# Altium project Encoder_w_LED_ring.PrjPcb
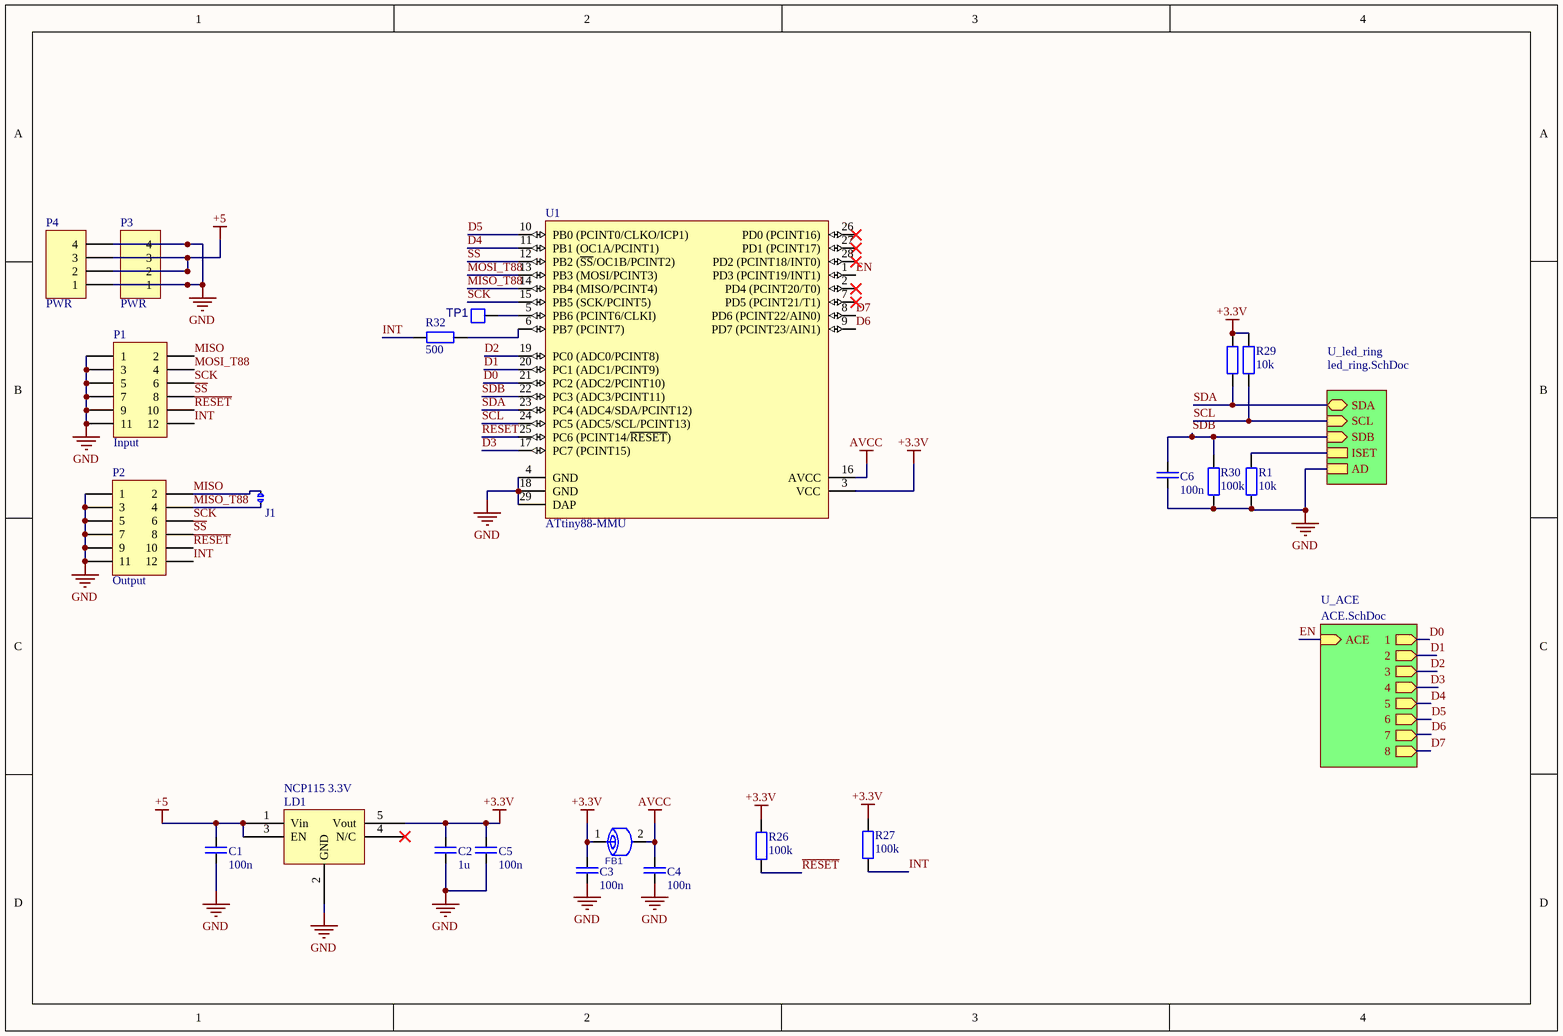
[diagram p0: main_sch.SchDoc]
3 sheets, 82 parts. Net scope: hierarchical (ports join the sheet entries above them; power ports are global).
Board files: PCB1.PcbDoc, PCB2.PcbDoc
Sheets:
  main_sch.SchDoc
    U_led_ring = led_ring.SchDoc
    U_ACE = ACE.SchDoc

## Sheet main_sch.SchDoc
size A4

### Parts
C1  100n  [R1005_0402i_L]
C2  1u  [C1608_0603I_L]
C3  100n  [R1005_0402i_L]
C4  100n  [R1005_0402i_L]
C5  100n  [R1005_0402i_L]
C6  100n  [R1005_0402i_L]
FB1  FERITTE BEAD  [R1608_0603I_L]  (value not drawn)
J1  Terminator  [solderJumper]  (value not drawn)
LD1  NCP115 3.3V  [TSOP95P280X110-6L]
P1  Input  [1.27mm SMD conn]
P2  Output  [1.27mm SMD conn]
P3  PWR  [HDR1X4]
P4  PWR  [HDR1X4]
R1  10k  [R1005_0402i_L]
R26  100k  [R1005_0402i_L]
R27  100k  [R1005_0402i_L]
R28  10k  [R1005_0402i_L]  (value not drawn)
R29  10k  [R1005_0402i_L]
R30  100k  [R1005_0402i_L]
R32  500  [R1005_0402i_L]
TP1  PAD  [PAD]  (value not drawn)
U1  ATtiny88-MMU  [28M1_N]

### Sub-sheets
U_ACE = ACE.SchDoc: 1 (out), 2 (out), 3 (out), 4 (out), 5 (out), 6 (out), 7 (out), 8 (out), ACE (in)
U_led_ring = led_ring.SchDoc: SDA (bidir), SCL (in), SDB (in), ISET, AD

### Nets
+3.3V: C2.1 C3.1 C5.1 FB1.1 LD1.5(Vout) R26.1 R27.1 R28.1 R29.1 U1.3(VCC)
+5: C1.1 LD1.1(Vin) LD1.3(EN) P3.2 P3.3 P4.2 P4.3
AVCC: C4.1 FB1.2 U1.16(AVCC)
GND: C1.2 C2.2 C3.2 C4.2 C5.2 C6.2 LD1.2(GND) P1.1 P1.3 P1.5 P1.7 P1.9 P1.11 P2.1 P2.3 P2.5 P2.7 P2.9 P2.11 P3.1 P3.4 P4.1 P4.4 R1.2 R30.2 U1.4(GND) U1.18(GND) U1.29(DAP) ; sheet U_led_ring/AD
D0: U1.21(PC2_(ADC2/PCINT10)) ; sheet U_ACE/1
D1: U1.20(PC1_(ADC1/PCINT9)) ; sheet U_ACE/2
D2: U1.19(PC0_(ADC0/PCINT8)) ; sheet U_ACE/3
D3: U1.17(PC7_(PCINT15)) ; sheet U_ACE/4
D4: U1.11(PB1_(OC1A/PCINT1)) ; sheet U_ACE/5
D5: U1.10(PB0_(PCINT0/CLKO/ICP1)) ; sheet U_ACE/6
D6: U1.9(PD7_(PCINT23/AIN1)) ; sheet U_ACE/7
D7: U1.8(PD6_(PCINT22/AIN0)) ; sheet U_ACE/8
EN: U1.1(PD3_(PCINT19/INT1)) ; sheet U_ACE/ACE
INT: P1.12 P2.12 R27.2 R32.1
MISO: J1.2 P1.2 P2.2
MISO_T88: J1.1 P2.4 U1.14(PB4_(MISO/PCINT4))
MOSI_T88: P1.4 U1.13(PB3_(MOSI/PCINT3))
~{RESET}: P1.10 P2.10 R26.2 U1.25(PC6_(PCINT14/~{RESET}))
~{SS}: P1.8 P2.8 U1.12(PB2_(~{SS}/OC1B/PCINT2))
SCK: P1.6 P2.6 U1.15(PB5_(SCK/PCINT5))
SCL: R29.2 U1.24(PC5_(ADC5/SCL/PCINT13)) ; sheet U_led_ring/SCL
SDA: R28.2 U1.23(PC4_(ADC4/SDA/PCINT12)) ; sheet U_led_ring/SDA
SDB: C6.1 R30.1 U1.22(PC3_(ADC3/PCINT11)) ; sheet U_led_ring/SDB
NetIS1_25: R1.1 ; sheet U_led_ring/ISET
NetR32_2: R32.2 U1.6(PB7_(PCINT7))
NetTP1_1: TP1.1 U1.5(PB6_(PCINT6/CLKI))

Not connected (* = marked no-connect by the designer): LD1 4(N/C)*; U1 2(PD4_(PCINT20/T0))* 7(PD5_(PCINT21/T1))* 26(PD0_(PCINT16))* 27(PD1_(PCINT17))* 28(PD2_(PCINT18/INT0))*

### Library data of the parts
C1-C6 = C: Capacitor
J1 = JMP_mini
P1 P2 = Header 6X2: Header, 6-Pin, Dual row; LatestRevisionDate: 17-Jul-2002; LatestRevisionNote: Re-released for DXP Platform.; Publisher: Altium Limited
P3 P4 = Header 4: Header, 4-Pin; LatestRevisionDate: 17-Jul-2002; LatestRevisionNote: Re-released for DXP Platform.; Publisher: Altium Limited
R1 R26-R30 R32 = R
U1 = ATtiny88-MMU: 8-bit AVR Microcontroller, 1.8-5.5V, 8KB Flash, 64 Bytes EEPROM, 512 Bytes SRAM, 28-pin MLF, Industrial Grade (-40°C to 85°C), Pb-Free; Published: 1-Apr-2010; DatasheetVersion: revC, Mar-2009; PackageVersion: revB, Nov-2008; PackageReference: 28M1; Publisher: Altium Limited; PackageDescription: 28-pad, 4x4x1.0mm Body, Pitch 0.45mm, 2.4x2.4mm Exposed Pad, Plastic Very Thin QFN Package (VQFN); Supplier 1: Digi-Key; Supplier Part Number 1: ATTINY88-MMU-ND; Supplier 2: Mouser; Supplier Part Number 2: 556-ATTINY88-MMU; ComponentLink1Description: Manufacturer Link; ComponentLink1URL: http://www.atmel.com/products/avr/default.asp?; ComponentLink2Description: ATtiny48/88 Datasheet; ComponentLink2URL: http://www.atmel.com/dyn/resources/prod_documents/doc8008.pdf; ComponentLink3Description: ATtiny48/88 Summary; ComponentLink3URL: http://www.atmel.com/dyn/resources/prod_documents/8008S.pdf; ComponentLink4Description: Atmel.com Home; ComponentLink4URL: http://www.atmel.com

## Sheet led_ring.SchDoc
size A4
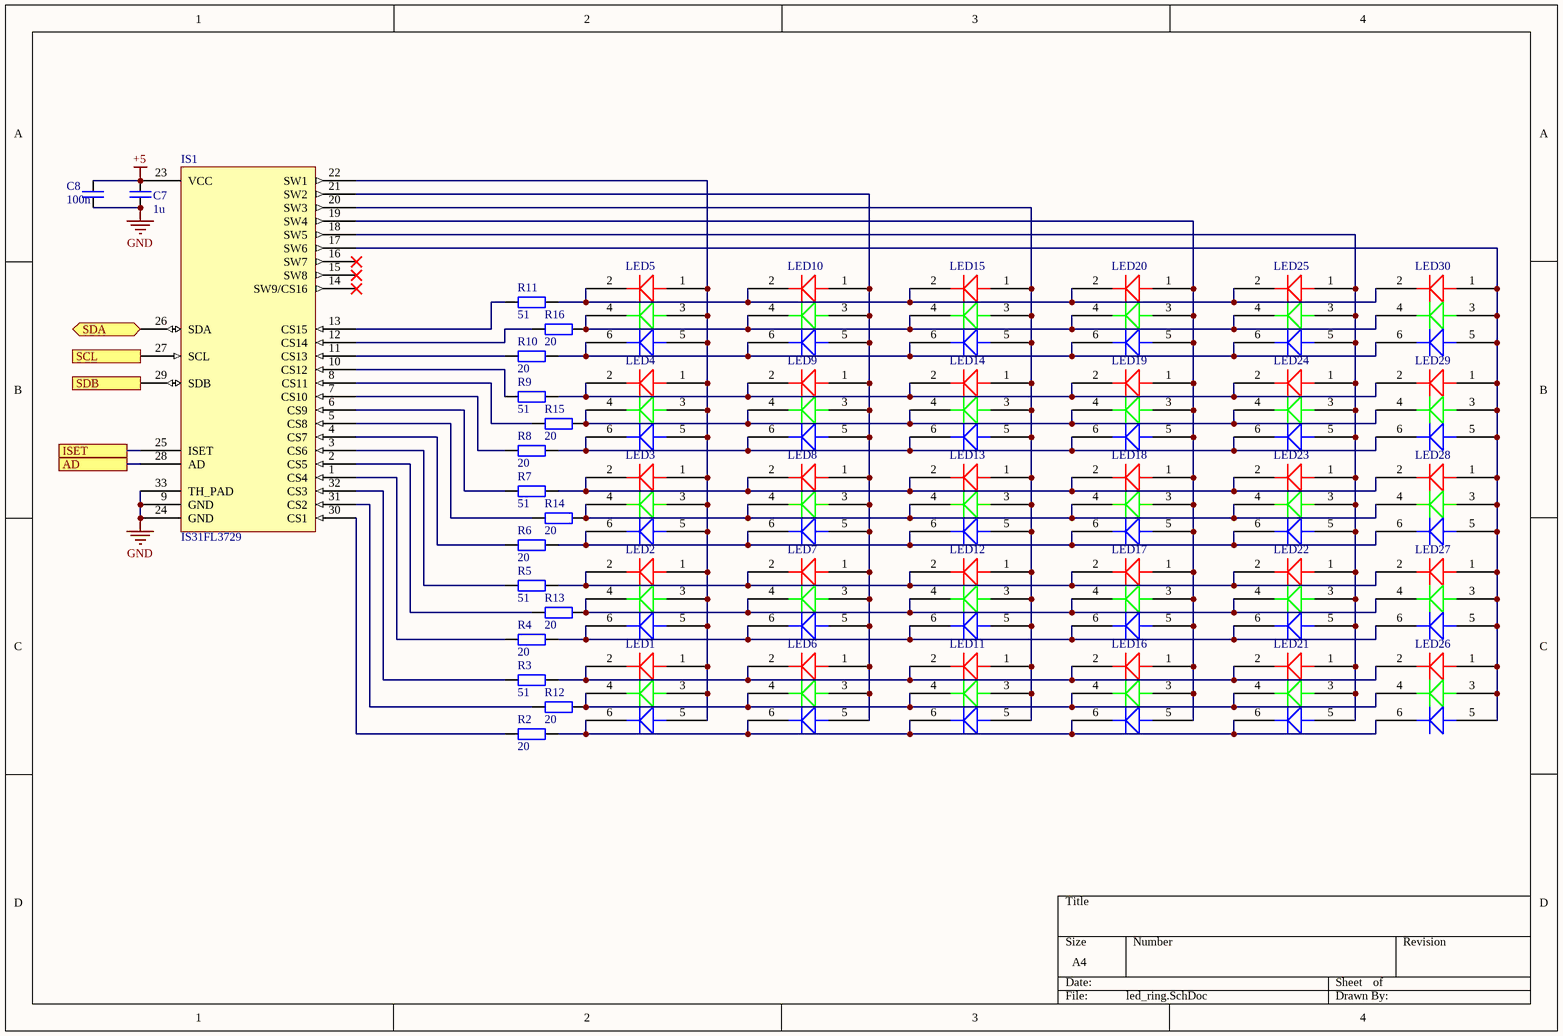
[diagram p1: led_ring.SchDoc]

### Parts
C7  1u  [C1608_0603I_L]
C8  100n  [R1005_0402i_L]
IS1  IS31FL3729  [QFN40P400X400X80_HS-33L]
LED1  SMB-LED  [ASMB-LED]  (value not drawn)
LED2  SMB-LED  [ASMB-LED]  (value not drawn)
LED3  SMB-LED  [ASMB-LED]  (value not drawn)
LED4  SMB-LED  [ASMB-LED]  (value not drawn)
LED5  SMB-LED  [ASMB-LED]  (value not drawn)
LED6  SMB-LED  [ASMB-LED]  (value not drawn)
LED7  SMB-LED  [ASMB-LED]  (value not drawn)
LED8  SMB-LED  [ASMB-LED]  (value not drawn)
LED9  SMB-LED  [ASMB-LED]  (value not drawn)
LED10  SMB-LED  [ASMB-LED]  (value not drawn)
LED11  SMB-LED  [ASMB-LED]  (value not drawn)
LED12  SMB-LED  [ASMB-LED]  (value not drawn)
LED13  SMB-LED  [ASMB-LED]  (value not drawn)
LED14  SMB-LED  [ASMB-LED]  (value not drawn)
LED15  SMB-LED  [ASMB-LED]  (value not drawn)
LED16  SMB-LED  [ASMB-LED]  (value not drawn)
LED17  SMB-LED  [ASMB-LED]  (value not drawn)
LED18  SMB-LED  [ASMB-LED]  (value not drawn)
LED19  SMB-LED  [ASMB-LED]  (value not drawn)
LED20  SMB-LED  [ASMB-LED]  (value not drawn)
LED21  SMB-LED  [ASMB-LED]  (value not drawn)
LED22  SMB-LED  [ASMB-LED]  (value not drawn)
LED23  SMB-LED  [ASMB-LED]  (value not drawn)
LED24  SMB-LED  [ASMB-LED]  (value not drawn)
LED25  SMB-LED  [ASMB-LED]  (value not drawn)
LED26  SMB-LED  [ASMB-LED]  (value not drawn)
LED27  SMB-LED  [ASMB-LED]  (value not drawn)
LED28  SMB-LED  [ASMB-LED]  (value not drawn)
LED29  SMB-LED  [ASMB-LED]  (value not drawn)
LED30  SMB-LED  [ASMB-LED]  (value not drawn)
R2  20  [R1005_0402i_L]
R3  51  [R1005_0402i_L]
R4  20  [R1005_0402i_L]
R5  51  [R1005_0402i_L]
R6  20  [R1005_0402i_L]
R7  51  [R1005_0402i_L]
R8  20  [R1005_0402i_L]
R9  51  [R1005_0402i_L]
R10  20  [R1005_0402i_L]
R11  51  [R1005_0402i_L]
R12  20  [R1005_0402i_L]
R13  20  [R1005_0402i_L]
R14  20  [R1005_0402i_L]
R15  20  [R1005_0402i_L]
R16  20  [R1005_0402i_L]

### Ports
AD, ISET, SCL (in), SDA (bidir), SDB (in)

### Nets
+5: C7.1 C8.1 IS1.23(VCC)
GND: C7.2 C8.2 IS1.9(GND) IS1.24(GND) IS1.28(AD) IS1.33(TH_PAD) ; port AD
SCL: IS1.27(SCL) ; port SCL
SDA: IS1.26(SDA) ; port SDA
SDB: IS1.29(SDB) ; port SDB
NetIS1_1: IS1.1(CS4) R4.1
NetIS1_2: IS1.2(CS5) R13.1
NetIS1_3: IS1.3(CS6) R5.1
NetIS1_4: IS1.4(CS7) R6.1
NetIS1_5: IS1.5(CS8) R14.1
NetIS1_6: IS1.6(CS9) R7.1
NetIS1_7: IS1.7(CS10) R8.1
NetIS1_8: IS1.8(CS11) R15.1
NetIS1_10: IS1.10(CS12) R9.1
NetIS1_11: IS1.11(CS13) R10.1
NetIS1_12: IS1.12(CS14) R16.1
NetIS1_13: IS1.13(CS15) R11.1
NetIS1_17: IS1.17(SW6) LED26.1 LED26.3 LED26.5 LED27.1 LED27.3 LED27.5 LED28.1 LED28.3 LED28.5 LED29.1 LED29.3 LED29.5 LED30.1 LED30.3 LED30.5
NetIS1_18: IS1.18(SW5) LED21.1 LED21.3 LED21.5 LED22.1 LED22.3 LED22.5 LED23.1 LED23.3 LED23.5 LED24.1 LED24.3 LED24.5 LED25.1 LED25.3 LED25.5
NetIS1_19: IS1.19(SW4) LED16.1 LED16.3 LED16.5 LED17.1 LED17.3 LED17.5 LED18.1 LED18.3 LED18.5 LED19.1 LED19.3 LED19.5 LED20.1 LED20.3 LED20.5
NetIS1_20: IS1.20(SW3) LED11.1 LED11.3 LED11.5 LED12.1 LED12.3 LED12.5 LED13.1 LED13.3 LED13.5 LED14.1 LED14.3 LED14.5 LED15.1 LED15.3 LED15.5
NetIS1_21: IS1.21(SW2) LED6.1 LED6.3 LED6.5 LED7.1 LED7.3 LED7.5 LED8.1 LED8.3 LED8.5 LED9.1 LED9.3 LED9.5 LED10.1 LED10.3 LED10.5
NetIS1_22: IS1.22(SW1) LED1.1 LED1.3 LED1.5 LED2.1 LED2.3 LED2.5 LED3.1 LED3.3 LED3.5 LED4.1 LED4.3 LED4.5 LED5.1 LED5.3 LED5.5
NetIS1_25: IS1.25(ISET) ; port ISET
NetIS1_30: IS1.30(CS1) R2.1
NetIS1_31: IS1.31(CS2) R12.1
NetIS1_32: IS1.32(CS3) R3.1
NetLED1_2: LED1.2 LED6.2 LED11.2 LED16.2 LED21.2 LED26.2 R3.2
NetLED1_4: LED1.4 LED6.4 LED11.4 LED16.4 LED21.4 LED26.4 R12.2
NetLED1_6: LED1.6 LED6.6 LED11.6 LED16.6 LED21.6 LED26.6 R2.2
NetLED2_2: LED2.2 LED7.2 LED12.2 LED17.2 LED22.2 LED27.2 R5.2
NetLED2_4: LED2.4 LED7.4 LED12.4 LED17.4 LED22.4 LED27.4 R13.2
NetLED2_6: LED2.6 LED7.6 LED12.6 LED17.6 LED22.6 LED27.6 R4.2
NetLED3_2: LED3.2 LED8.2 LED13.2 LED18.2 LED23.2 LED28.2 R7.2
NetLED3_4: LED3.4 LED8.4 LED13.4 LED18.4 LED23.4 LED28.4 R14.2
NetLED3_6: LED3.6 LED8.6 LED13.6 LED18.6 LED23.6 LED28.6 R6.2
NetLED4_2: LED4.2 LED9.2 LED14.2 LED19.2 LED24.2 LED29.2 R9.2
NetLED4_4: LED4.4 LED9.4 LED14.4 LED19.4 LED24.4 LED29.4 R15.2
NetLED4_6: LED4.6 LED9.6 LED14.6 LED19.6 LED24.6 LED29.6 R8.2
NetLED5_2: LED5.2 LED10.2 LED15.2 LED20.2 LED25.2 LED30.2 R11.2
NetLED5_4: LED5.4 LED10.4 LED15.4 LED20.4 LED25.4 LED30.4 R16.2
NetLED5_6: LED5.6 LED10.6 LED15.6 LED20.6 LED25.6 LED30.6 R10.2

Not connected (* = marked no-connect by the designer): IS1 14(SW9/CS16)* 15(SW8)* 16(SW7)*

### Library data of the parts
C7 C8 = C: Capacitor
LED1-LED30 = ASMB-LED
R2-R16 = R

## Sheet ACE.SchDoc
size A4
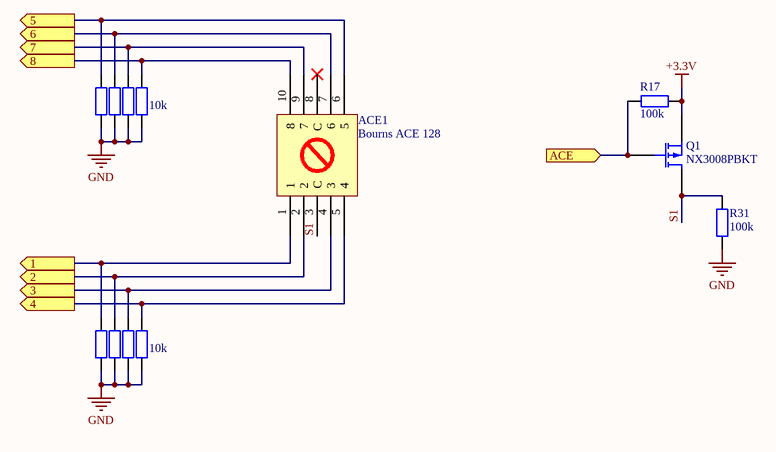
[diagram p2: ACE.SchDoc]

### Parts
ACE1  Bourns ACE 128  [Bourns ACE 128]
Q1  NX3008PBKT  [SOT95P230X110-3L]
R17  100k  [R1005_0402i_L]
R18  10k  [R1005_0402i_L]  (value not drawn)
R19  10k  [R1005_0402i_L]  (value not drawn)
R20  10k  [R1005_0402i_L]  (value not drawn)
R21  10k  [R1005_0402i_L]
R22  10k  [R1005_0402i_L]  (value not drawn)
R23  10k  [R1005_0402i_L]  (value not drawn)
R24  10k  [R1005_0402i_L]  (value not drawn)
R25  10k  [R1005_0402i_L]
R31  100k  [R1005_0402i_L]

### Ports
1 (out), 2 (out), 3 (out), 4 (out), 5 (out), 6 (out), 7 (out), 8 (out), ACE (in)

### Nets
+3.3V: Q1.2(S) R17.2
GND: R18.1 R19.1 R20.1 R21.1 R22.1 R23.1 R24.1 R25.1 R31.1
D0: ACE1.1 R22.2 ; port 1
D1: ACE1.2 R23.2 ; port 2
D2: ACE1.4(3) R24.2 ; port 3
D3: ACE1.5(4) R25.2 ; port 4
D4: ACE1.6(5) R18.2 ; port 5
D5: ACE1.7(6) R19.2 ; port 6
D6: ACE1.9(7) R20.2 ; port 7
D7: ACE1.10(8) R21.2 ; port 8
EN: Q1.1(G) R17.1 ; port ACE
S1: ACE1.3(C) Q1.3(D) R31.2

Not connected (* = marked no-connect by the designer): ACE1 8(C)*

### Library data of the parts
Q1 = MOSFET-P: P-Channel MOSFET; Published: 8-Jun-2000; LatestRevisionDate: 17-Jul-2002; LatestRevisionNote: Re-released for DXP Platform.; PackageVersion: 1995/1996; PackageReference: E3; Publisher: Altium Limited; PackageDescription: TO, Flat Index; 3 In-Line, Axial Leads; Body Dia. 4.6mm; Lead Dia. 0.5 mm (max)
R17-R25 R31 = R

## Nets that join several sheets
+3.3V: main_sch (10 pins), ACE (Q1.2 R17.2)
+5: main_sch (7 pins), led_ring (C7.1 C8.1 IS1.23)
GND: main_sch (28 pins), led_ring (6 pins), ACE (9 pins)
D0: main_sch (U1.21), ACE (ACE1.1 R22.2)
D1: main_sch (U1.20), ACE (ACE1.2 R23.2)
D2: main_sch (U1.19), ACE (ACE1.4 R24.2)
D3: main_sch (U1.17), ACE (ACE1.5 R25.2)
D4: main_sch (U1.11), ACE (ACE1.6 R18.2)
D5: main_sch (U1.10), ACE (ACE1.7 R19.2)
D6: main_sch (U1.9), ACE (ACE1.9 R20.2)
D7: main_sch (U1.8), ACE (ACE1.10 R21.2)
EN: main_sch (U1.1), ACE (Q1.1 R17.1)
NetIS1_25: main_sch (R1.1), led_ring (IS1.25)
SCL: main_sch (R29.2 U1.24), led_ring (IS1.27)
SDA: main_sch (R28.2 U1.23), led_ring (IS1.26)
SDB: main_sch (C6.1 R30.1 U1.22), led_ring (IS1.29)